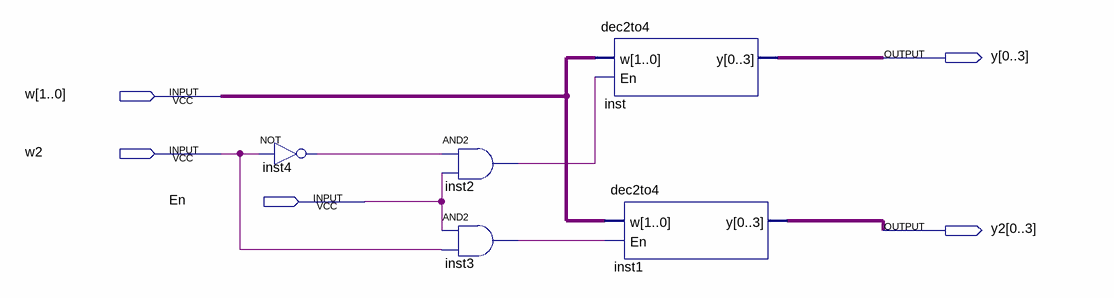
[diagram p0: schematic sheet]
// Quartus schematic decoderBlock.bdf as structural Verilog: 5 symbols, 5 pins
module decoderBlock (
  input  [1:0] w,
  input  w2,
  input  En,
  output [0:3] y,
  output [0:3] y2
);

  wire inst2_out, inst3_out, inst4_out;

  not inst4 (inst4_out, w2);
  and inst2 (inst2_out, inst4_out, En);
  and inst3 (inst3_out, En, w2);
  dec2to4 inst (.w(w), .En(inst2_out), .y(y));
  dec2to4 inst1 (.w(w), .En(inst3_out), .y(y2));
endmodule
